# Altium schematic sheet PCB_axel_lampe.SchDoc
size A4
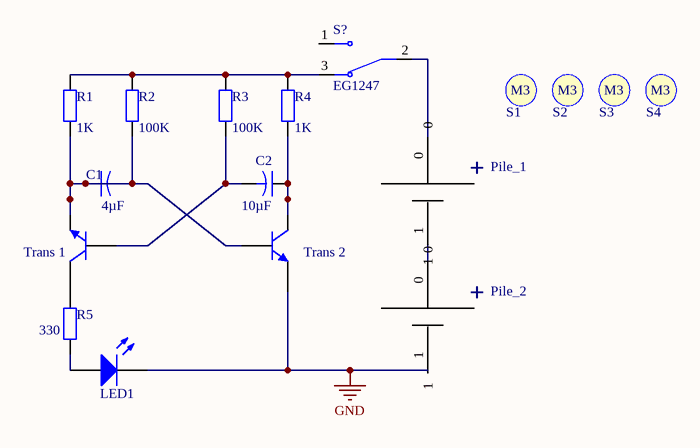
[diagram p0: PCB_axel_lampe.SchDoc]

## Parts
?  LED1  [LED-1]
C1  value 4µF  [Capacitor 1206]
C2  value 10µF  [Capacitor 1206]
Pile_1  (no value)  [PCBComponent_1]
Pile_2  Pile_2  [PCBComponent_1]  (value not drawn)
R1  value 1K  [Resistor 1206]
R2  value 100K  [Resistor 1206]
R3  value 100K  [Resistor 1206]
R4  value 1K  [Resistor 1206]
R5  value 330  [Resistor 1206]
S1  Screw M3  [Screw M3]  (value not drawn)
S2  Screw M3  [Screw M3]  (value not drawn)
S3  Screw M3  [Screw M3]  (value not drawn)
S4  Screw M3  [Screw M3]  (value not drawn)
S?  EG1247  [SW_EG1247]
Trans_1  (no value)  [TO92250P510H770-3]
Trans_2  2N3904  [TO92250P510H770-3]  (value not drawn)

## Nets
GND: ?.2(K) Trans_2.1(E)
Net?_1: ?.1(A) R5.1
NetC1_1: C1.1 C1.2 R1.1 R2.1 Trans_1.1(E) Trans_2.2(B)
NetC2_1: C2.1 R4.1 Trans_2.3(C)
NetC2_2: C2.2 R3.1 Trans_1.2(B)
NetR1_2: R1.2 R2.2 R3.2 R4.2 S?.3
NetR5_2: R5.2 Trans_1.3(C)

Not connected (* = marked no-connect by the designer): Pile_1 0 1; Pile_2 0 1; S? 1 2

## Notes on the sheet
- (in symbol Component_1) +
- (in symbol Screw M3) M3

## Library data of the parts
? = LED1: Typical RED GaAs LED; Published: 8-Jun-2000; LatestRevisionDate: 08-Jul-2005; LatestRevisionNote: Mech Layer 1 removed.; PackageReference: LED-1; Publisher: Altium Limited; PackageDescription: LED; 2 Leads
C1 C2 = Cap2: Capacitor; Published: 23-Sep-2002; PackageReference: CAPR5-4X5; Publisher: Altium Limited; PackageDescription: Capacitor; 2 Leads
Pile_1 Pile_2 = Component_1
R1-R5 = Res2: Resistor; Published: 8-Jun-2000; LatestRevisionDate: 17-Jul-2002; LatestRevisionNote: Re-released for DXP Platform.; PackageReference: AXIAL-0.4; Publisher: Altium Limited; PackageDescription: Axial Device, Thru-Hole; 2 Leads; 0.4 in Pin Spacing
S? = EG1247: Slide Switch SPDT Through Hole, Right Angle; MF: E-Switch; Availability: In Stock; Value: *; Price: None; Check_prices: https://www.snapeda.com/parts/EG1247/E-Switch/view-part/?ref=eda; Purchase-URL: https://pricing.snapeda.com/search/part/EG1247/?ref=eda; SnapEDA_Link: https://www.snapeda.com/parts/EG1247/E-Switch/view-part/?ref=snap; MP: EG1247; Package: None
Trans_1 Trans_2 = 2N3904: NPN General Purpose Amplifier; Published: 8-Jun-2000; LatestRevisionDate: 15-Jan-2003; LatestRevisionNote: PCB Footprint 'BCY-W3/D4.7' replaced; DatasheetVersion: 1997; PackageVersion: Sep-1998; PackageReference: TO-92A; Publisher: Altium Limited; PackageDescription: TO, Flat Index; 3 In-Line, Axial Leads; Body Dia. 4.5mm; Leads 0.51 x 0.48 mm (max); ComponentLink1Description: Manufacturer Link; ComponentLink1URL: http://www.fairchildsemi.com/; ComponentLink2Description: Datasheet; ComponentLink2URL: http://www.fairchildsemi.com/ds/2N%2F2N3904.pdf